# Altium schematic sheet cpu2_lock_control2.SchDoc
size A3; DocumentNumber: 9; Revision: V1.0; SheetNumber: 9; SheetTotal: 9; Rule: PcbType=ProtelPcb
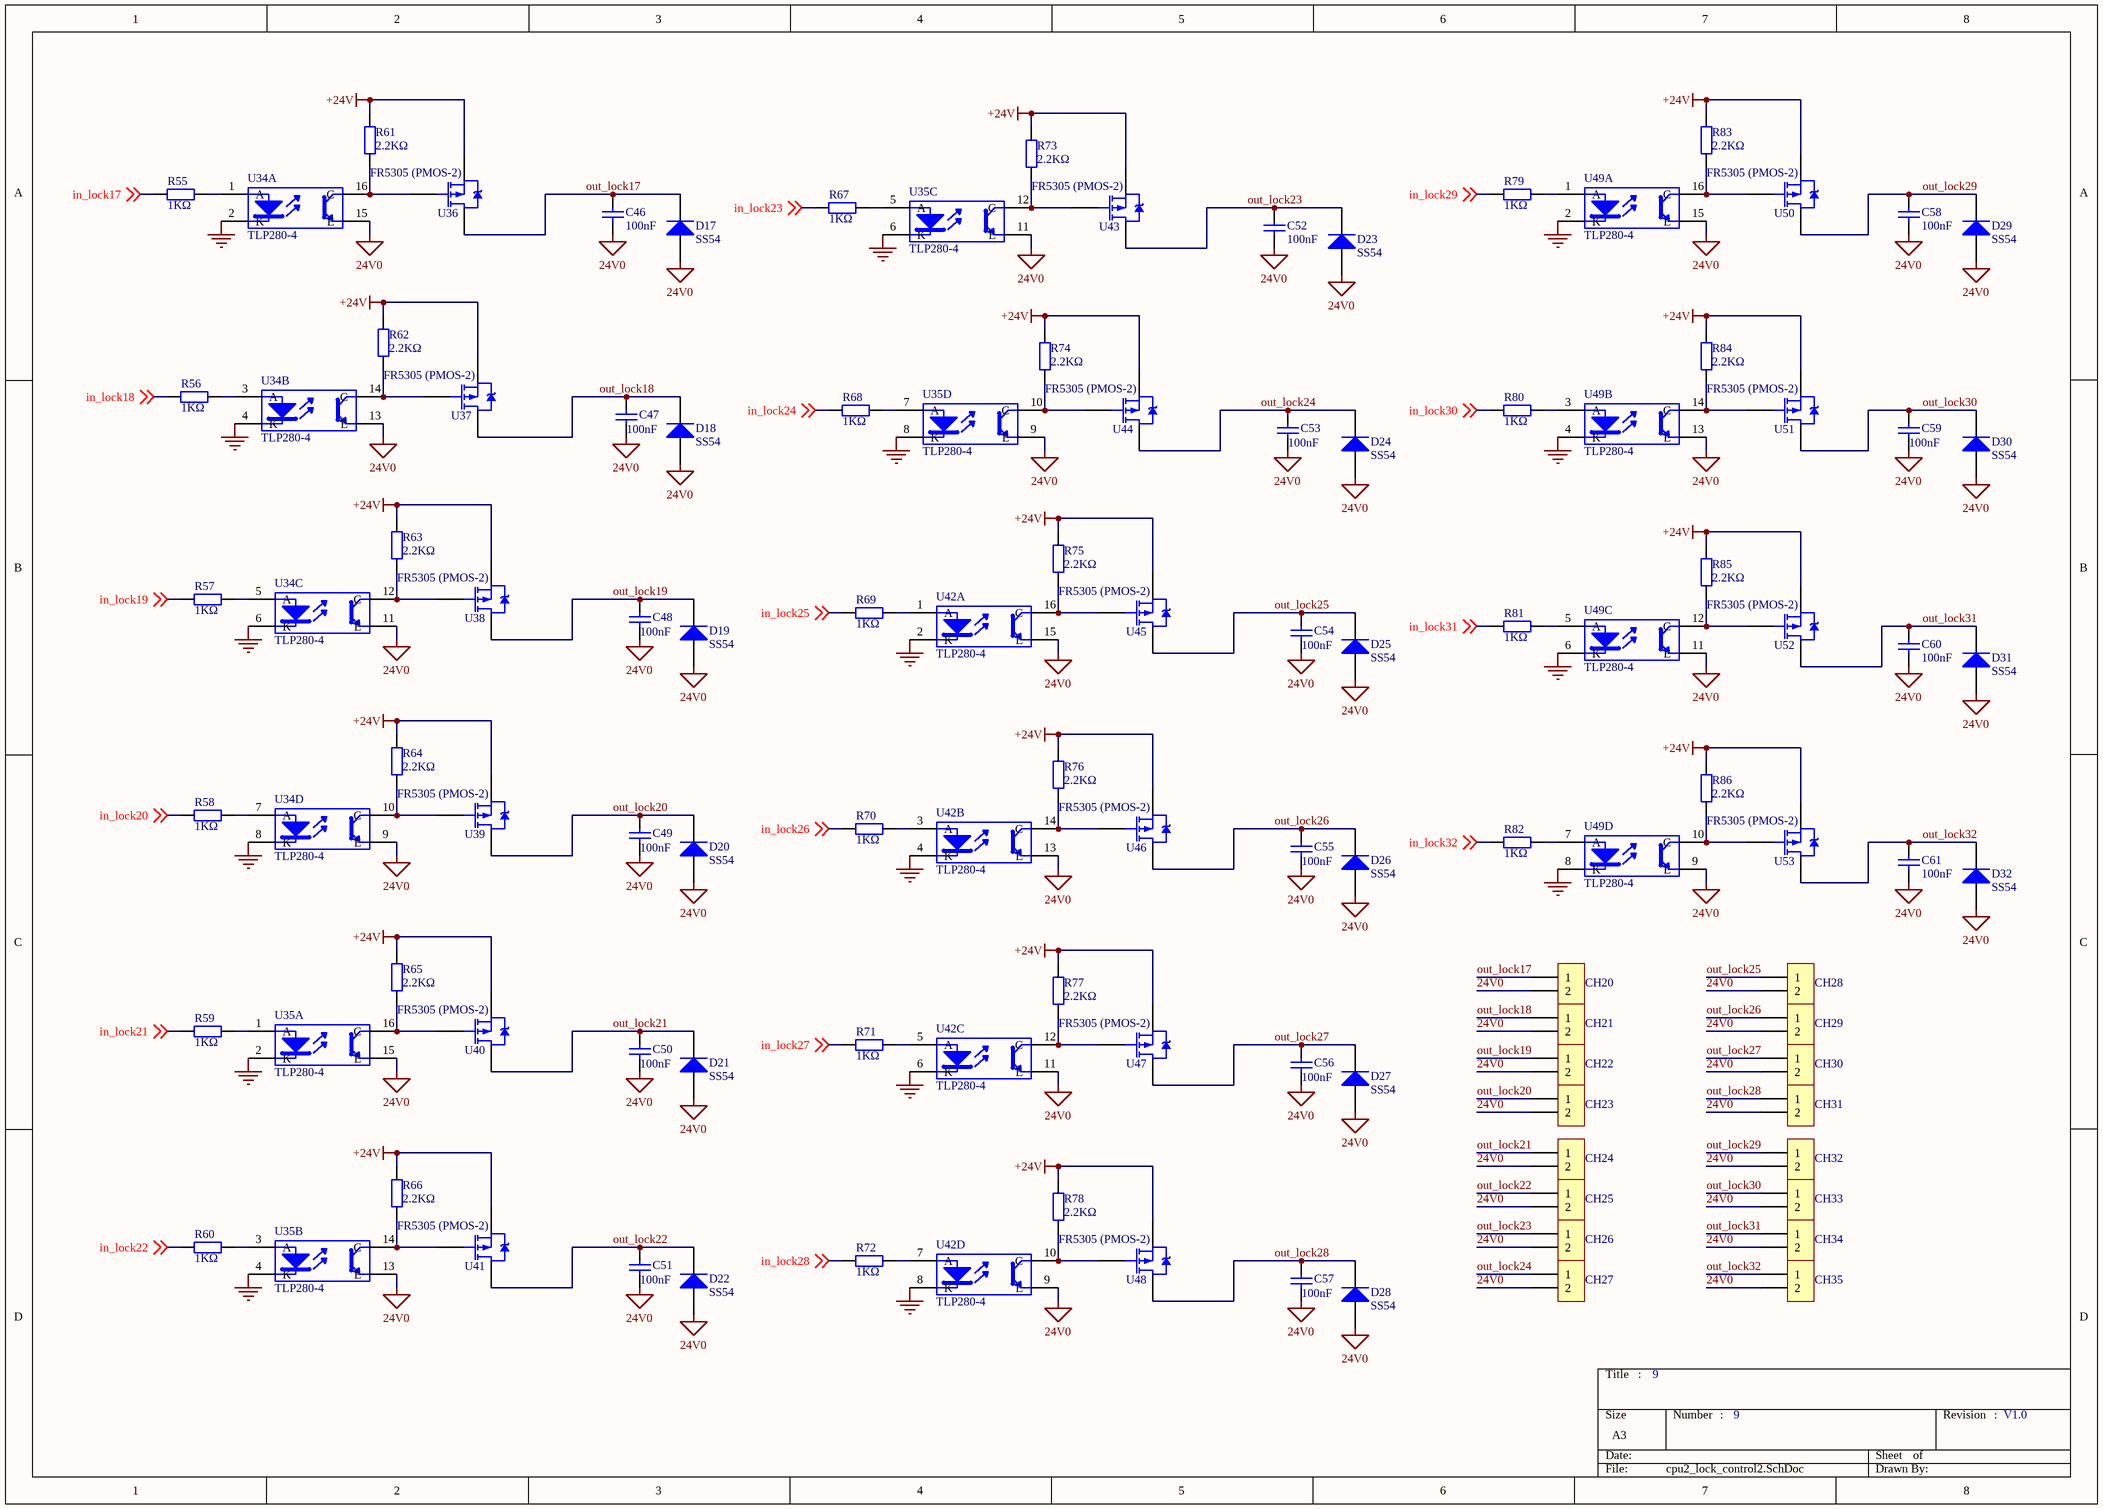
[diagram p0: cpu2_lock_control2.SchDoc]

## Parts
C46  100nF  [0805_C]
C47  100nF  [0805_C]
C48  100nF  [0805_C]
C49  100nF  [0805_C]
C50  100nF  [0805_C]
C51  100nF  [0805_C]
C52  100nF  [0805_C]
C53  100nF  [0805_C]
C54  100nF  [0805_C]
C55  100nF  [0805_C]
C56  100nF  [0805_C]
C57  100nF  [0805_C]
C58  100nF  [0805_C]
C59  100nF  [0805_C]
C60  100nF  [0805_C]
C61  100nF  [0805_C]
CH20  HEADER1X2  [CH3.96-2PIN]  (value not drawn)
CH21  HEADER1X2  [CH3.96-2PIN]  (value not drawn)
CH22  HEADER1X2  [CH3.96-2PIN]  (value not drawn)
CH23  HEADER1X2  [CH3.96-2PIN]  (value not drawn)
CH24  HEADER1X2  [CH3.96-2PIN]  (value not drawn)
CH25  HEADER1X2  [CH3.96-2PIN]  (value not drawn)
CH26  HEADER1X2  [CH3.96-2PIN]  (value not drawn)
CH27  HEADER1X2  [CH3.96-2PIN]  (value not drawn)
CH28  HEADER1X2  [CH3.96-2PIN]  (value not drawn)
CH29  HEADER1X2  [CH3.96-2PIN]  (value not drawn)
CH30  HEADER1X2  [CH3.96-2PIN]  (value not drawn)
CH31  HEADER1X2  [CH3.96-2PIN]  (value not drawn)
CH32  HEADER1X2  [CH3.96-2PIN]  (value not drawn)
CH33  HEADER1X2  [CH3.96-2PIN]  (value not drawn)
CH34  HEADER1X2  [CH3.96-2PIN]  (value not drawn)
CH35  HEADER1X2  [CH3.96-2PIN]  (value not drawn)
D17  SS54  [SMA(DO-214AC)_S1]
D18  SS54  [SMA(DO-214AC)_S1]
D19  SS54  [SMA(DO-214AC)_S1]
D20  SS54  [SMA(DO-214AC)_S1]
D21  SS54  [SMA(DO-214AC)_S1]
D22  SS54  [SMA(DO-214AC)_S1]
D23  SS54  [SMA(DO-214AC)_S1]
D24  SS54  [SMA(DO-214AC)_S1]
D25  SS54  [SMA(DO-214AC)_S1]
D26  SS54  [SMA(DO-214AC)_S1]
D27  SS54  [SMA(DO-214AC)_S1]
D28  SS54  [SMA(DO-214AC)_S1]
D29  SS54  [SMA(DO-214AC)_S1]
D30  SS54  [SMA(DO-214AC)_S1]
D31  SS54  [SMA(DO-214AC)_S1]
D32  SS54  [SMA(DO-214AC)_S1]
R55  1KΩ  [0805_R]
R56  1KΩ  [0805_R]
R57  1KΩ  [0805_R]
R58  1KΩ  [0805_R]
R59  1KΩ  [0805_R]
R60  1KΩ  [0805_R]
R61  2.2KΩ  [0805_R]
R62  2.2KΩ  [0805_R]
R63  2.2KΩ  [0805_R]
R64  2.2KΩ  [0805_R]
R65  2.2KΩ  [0805_R]
R66  2.2KΩ  [0805_R]
R67  1KΩ  [0805_R]
R68  1KΩ  [0805_R]
R69  1KΩ  [0805_R]
R70  1KΩ  [0805_R]
R71  1KΩ  [0805_R]
R72  1KΩ  [0805_R]
R73  2.2KΩ  [0805_R]
R74  2.2KΩ  [0805_R]
R75  2.2KΩ  [0805_R]
R76  2.2KΩ  [0805_R]
R77  2.2KΩ  [0805_R]
R78  2.2KΩ  [0805_R]
R79  1KΩ  [0805_R]
R80  1KΩ  [0805_R]
R81  1KΩ  [0805_R]
R82  1KΩ  [0805_R]
R83  2.2KΩ  [0805_R]
R84  2.2KΩ  [0805_R]
R85  2.2KΩ  [0805_R]
R86  2.2KΩ  [0805_R]
U34  TLP280-4  [SO16]  (parts A,B,C,D of 4)
U35  TLP280-4  [SO16]  (parts A,B,C,D of 4)
U36  FR5305 (PMOS-2)  [TO-252]
U37  FR5305 (PMOS-2)  [TO-252]
U38  FR5305 (PMOS-2)  [TO-252]
U39  FR5305 (PMOS-2)  [TO-252]
U40  FR5305 (PMOS-2)  [TO-252]
U41  FR5305 (PMOS-2)  [TO-252]
U42  TLP280-4  [SO16]  (parts A,B,C,D of 4)
U43  FR5305 (PMOS-2)  [TO-252]
U44  FR5305 (PMOS-2)  [TO-252]
U45  FR5305 (PMOS-2)  [TO-252]
U46  FR5305 (PMOS-2)  [TO-252]
U47  FR5305 (PMOS-2)  [TO-252]
U48  FR5305 (PMOS-2)  [TO-252]
U49  TLP280-4  [SO16]  (parts A,B,C,D of 4)
U50  FR5305 (PMOS-2)  [TO-252]
U51  FR5305 (PMOS-2)  [TO-252]
U52  FR5305 (PMOS-2)  [TO-252]
U53  FR5305 (PMOS-2)  [TO-252]

## Nets
24V0: C46.1 C47.1 C48.1 C49.1 C50.1 C51.1 C52.1 C53.1 C54.1 C55.1 C56.1 C57.1 C58.1 C59.1 C60.1 C61.1 CH20.2 CH21.2 CH22.2 CH23.2 CH24.2 CH25.2 CH26.2 CH27.2 CH28.2 CH29.2 CH30.2 CH31.2 CH32.2 CH33.2 CH34.2 CH35.2 D17.1(A) D18.1(A) D19.1(A) D20.1(A) D21.1(A) D22.1(A) D23.1(A) D24.1(A) D25.1(A) D26.1(A) D27.1(A) D28.1(A) D29.1(A) D30.1(A) D31.1(A) D32.1(A) U34.9(E) U34.11(E) U34.13(E) U34.15(E) U35.9(E) U35.11(E) U35.13(E) U35.15(E) U42.9(E) U42.11(E) U42.13(E) U42.15(E) U49.9(E) U49.11(E) U49.13(E) U49.15(E)
+24V: R61.2 R62.2 R63.2 R64.2 R65.2 R66.2 R73.2 R74.2 R75.2 R76.2 R77.2 R78.2 R83.2 R84.2 R85.2 R86.2 U36.3(S) U37.3(S) U38.3(S) U39.3(S) U40.3(S) U41.3(S) U43.3(S) U44.3(S) U45.3(S) U46.3(S) U47.3(S) U48.3(S) U50.3(S) U51.3(S) U52.3(S) U53.3(S)
GND: U34.2(K) U34.4(K) U34.6(K) U34.8(K) U35.2(K) U35.4(K) U35.6(K) U35.8(K) U42.2(K) U42.4(K) U42.6(K) U42.8(K) U49.2(K) U49.4(K) U49.6(K) U49.8(K)
in_lock17: R55.1 ; off-sheet in_lock17
in_lock18: R56.1 ; off-sheet in_lock18
in_lock19: R57.1 ; off-sheet in_lock19
in_lock20: R58.1 ; off-sheet in_lock20
in_lock21: R59.1 ; off-sheet in_lock21
in_lock22: R60.1 ; off-sheet in_lock22
in_lock23: R67.1 ; off-sheet in_lock23
in_lock24: R68.1 ; off-sheet in_lock24
in_lock25: R69.1 ; off-sheet in_lock25
in_lock26: R70.1 ; off-sheet in_lock26
in_lock27: R71.1 ; off-sheet in_lock27
in_lock28: R72.1 ; off-sheet in_lock28
in_lock29: R79.1 ; off-sheet in_lock29
in_lock30: R80.1 ; off-sheet in_lock30
in_lock31: R81.1 ; off-sheet in_lock31
in_lock32: R82.1 ; off-sheet in_lock32
out_lock17: C46.2 CH20.1 D17.2(K) U36.2(D)
out_lock18: C47.2 CH21.1 D18.2(K) U37.2(D)
out_lock19: C48.2 CH22.1 D19.2(K) U38.2(D)
out_lock20: C49.2 CH23.1 D20.2(K) U39.2(D)
out_lock21: C50.2 CH24.1 D21.2(K) U40.2(D)
out_lock22: C51.2 CH25.1 D22.2(K) U41.2(D)
out_lock23: C52.2 CH26.1 D23.2(K) U43.2(D)
out_lock24: C53.2 CH27.1 D24.2(K) U44.2(D)
out_lock25: C54.2 CH28.1 D25.2(K) U45.2(D)
out_lock26: C55.2 CH29.1 D26.2(K) U46.2(D)
out_lock27: C56.2 CH30.1 D27.2(K) U47.2(D)
out_lock28: C57.2 CH31.1 D28.2(K) U48.2(D)
out_lock29: C58.2 CH32.1 D29.2(K) U50.2(D)
out_lock30: C59.2 CH33.1 D30.2(K) U51.2(D)
out_lock31: C60.2 CH34.1 D31.2(K) U52.2(D)
out_lock32: C61.2 CH35.1 D32.2(K) U53.2(D)
NetR55_2: R55.2 U34.1(A)
NetR56_2: R56.2 U34.3(A)
NetR57_2: R57.2 U34.5(A)
NetR58_2: R58.2 U34.7(A)
NetR59_2: R59.2 U35.1(A)
NetR60_2: R60.2 U35.3(A)
NetR61_1: R61.1 U34.16(C) U36.1(G)
NetR62_1: R62.1 U34.14(C) U37.1(G)
NetR63_1: R63.1 U34.12(C) U38.1(G)
NetR64_1: R64.1 U34.10(C) U39.1(G)
NetR65_1: R65.1 U35.16(C) U40.1(G)
NetR66_1: R66.1 U35.14(C) U41.1(G)
NetR67_2: R67.2 U35.5(A)
NetR68_2: R68.2 U35.7(A)
NetR69_2: R69.2 U42.1(A)
NetR70_2: R70.2 U42.3(A)
NetR71_2: R71.2 U42.5(A)
NetR72_2: R72.2 U42.7(A)
NetR73_1: R73.1 U35.12(C) U43.1(G)
NetR74_1: R74.1 U35.10(C) U44.1(G)
NetR75_1: R75.1 U42.16(C) U45.1(G)
NetR76_1: R76.1 U42.14(C) U46.1(G)
NetR77_1: R77.1 U42.12(C) U47.1(G)
NetR78_1: R78.1 U42.10(C) U48.1(G)
NetR79_2: R79.2 U49.1(A)
NetR80_2: R80.2 U49.3(A)
NetR81_2: R81.2 U49.5(A)
NetR82_2: R82.2 U49.7(A)
NetR83_1: R83.1 U49.16(C) U50.1(G)
NetR84_1: R84.1 U49.14(C) U51.1(G)
NetR85_1: R85.1 U49.12(C) U52.1(G)
NetR86_1: R86.1 U49.10(C) U53.1(G)

## Notes on the sheet
- :

## Library data of the parts
C46-C61 = 0805 100nF(104) 10% 50V: 贴片电容; ComponentLink1Description: 供应商链接; ComponentLink1URL: http://www.szlcsc.com/product/details_50686.html; Package: 0805; Supplier: LC; SuppliersPartNumber: C49678
D17-D32 = SMA(DO-214AC) SS54: 二极管; ComponentLink1Description: 供应商链接; ComponentLink1URL: http://www.szlcsc.com/product/details_23178.html; Package: SMA(DO-214AC); Supplier: LC; SuppliersPartNumber: C22452
R55-R86 = 0805 11KΩ (1102) 1%: 贴片电阻; ComponentLink1Description: 供应商链接; ComponentLink1URL: http://www.szlcsc.com/product/details_18117.html; Package: 0805; Supplier: LC; SuppliersPartNumber: C17429
U34 U35 U42 U49 = TLP521-4
U36-U41 U43-U48 U50-U53 = PMOS-2: P-Channel Power MOSFET; Note: Pin 4 not drawn and electrically connected to Pin 2.; Published: 8-Jun-2000; LatestRevisionDate: 17-Jul-2002; LatestRevisionNote: Re-released for DXP Platform.; DatasheetDocument: PD-9.390D; PackageReference: TO-220AB; Publisher: Altium Limited; Code_JEDEC: TO-220-AB; ComponentLink1Description: Manufacturer Link; ComponentLink1URL: http://www.irf.com/